# Altium schematic sheet ATB-Basics-PartA.SchDoc
size A4
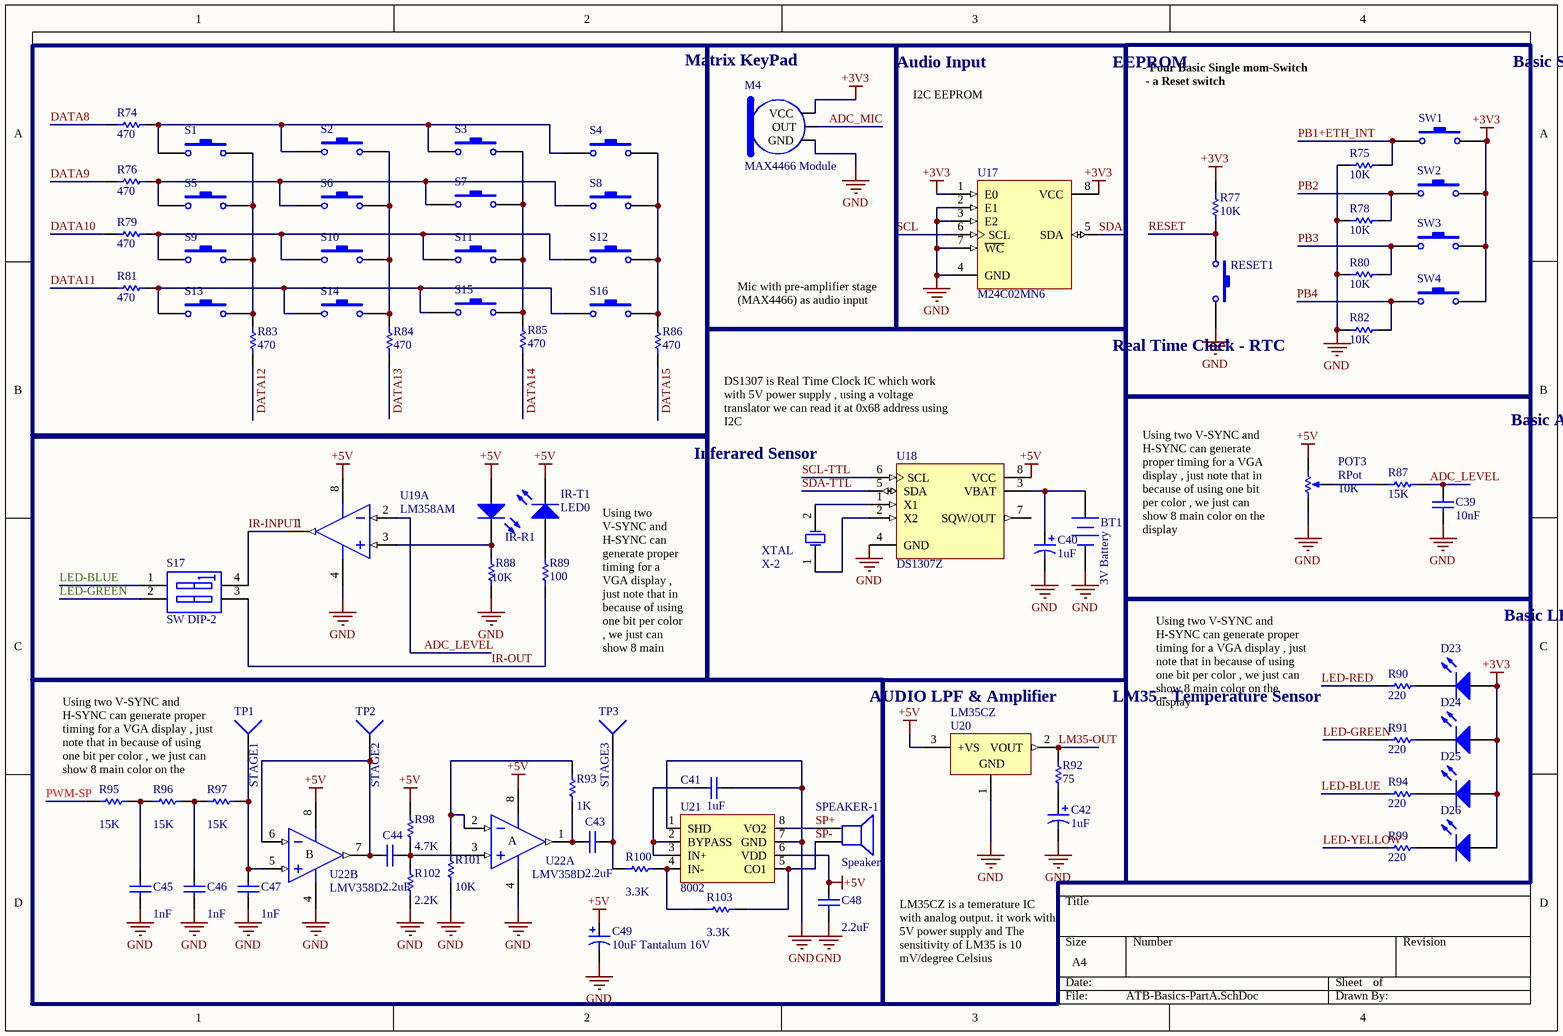
[diagram p0: ATB-Basics-PartA.SchDoc]

## Parts
BT1  3V Battery  [BAT-3V]
C39  10nF  [SMD_R0805]
C40  1uF  [SMD_C0805]
C41  1uF  [SMD_C0805]
C42  1uF  [SMD_C0805]
C43  2.2uF  [SMD_C0805]
C44  2.2uF  [SMD_C0805]
C45  1nF  [SMD_C0805]
C46  1nF  [SMD_C0805]
C47  1nF  [SMD_C0805]
C48  2.2uF  [SMD_C0805]
C49  10uF Tantalum 16V  [SMD_C3528-P]
D23  LED0  [3.5X2.8X1.9]  (value not drawn)
D24  LED0  [3.5X2.8X1.9]  (value not drawn)
D25  LED0  [3.5X2.8X1.9]  (value not drawn)
D26  LED0  [3.5X2.8X1.9]  (value not drawn)
IR-R1  (no value)  [LED-0]
IR-T1  LED0  [LED-0]
M4  MAX4466 Module  [MAX4466-Module]
POT3  RPot  value 10K  [volom]
R74  470  [SMD_R0805]
R75  10K  [SMD_R0805]
R76  470  [SMD_R0805]
R77  10K  [SMD_R0805]
R78  10K  [SMD_R0805]
R79  470  [SMD_R0805]
R80  10K  [SMD_R0805]
R81  470  [SMD_R0805]
R82  10K  [SMD_R0805]
R83  470  [SMD_R0805]
R84  470  [SMD_R0805]
R85  470  [SMD_R0805]
R86  470  [SMD_R0805]
R87  15K  [SMD_R0805]
R88  10K  [SMD_R0805]
R89  100  [SMD_R0805]
R90  220  [SMD_R0805]
R91  220  [SMD_R0805]
R92  75  [SMD_R0805]
R93  1K  [SMD_R0805]
R94  220  [SMD_R0805]
R95  15K  [SMD_R0805]
R96  15K  [SMD_R0805]
R97  15K  [SMD_R0805]
R98  4.7K  [SMD_R0805]
R99  220  [SMD_R0805]
R100  3.3K  [SMD_R0805]
R101  10K  [SMD_R0805]
R102  2.2K  [SMD_R0805]
R103  3.3K  [SMD_R0805]
RESET1  SW-PB  [mom-sw]  (value not drawn)
S1  SW-PB  [mom-sw]  (value not drawn)
S2  SW-PB  [mom-sw]  (value not drawn)
S3  SW-PB  [mom-sw]  (value not drawn)
S4  SW-PB  [mom-sw]  (value not drawn)
S5  SW-PB  [mom-sw]  (value not drawn)
S6  SW-PB  [mom-sw]  (value not drawn)
S7  SW-PB  [mom-sw]  (value not drawn)
S8  SW-PB  [mom-sw]  (value not drawn)
S9  SW-PB  [mom-sw]  (value not drawn)
S10  SW-PB  [mom-sw]  (value not drawn)
S11  SW-PB  [mom-sw]  (value not drawn)
S12  SW-PB  [mom-sw]  (value not drawn)
S13  SW-PB  [mom-sw]  (value not drawn)
S14  SW-PB  [mom-sw]  (value not drawn)
S15  SW-PB  [mom-sw]  (value not drawn)
S16  SW-PB  [mom-sw]  (value not drawn)
S17  SW DIP-2  [DIP-4]
SPEAKER-1  Speaker  [SPEAKER 2.5X1.5]
SW1  SW-PB  [SW-4PIN]  (value not drawn)
SW2  SW-PB  [SW-4PIN]  (value not drawn)
SW3  SW-PB  [SW-4PIN]  (value not drawn)
SW4  SW-PB  [SW-4PIN]  (value not drawn)
TP1  STAGE1  [TP]  (no BOM)
TP2  STAGE2  [TP]  (no BOM)
TP3  STAGE3  [TP]  (no BOM)
U17  M24C02MN6  [SOP8_N]
U18  DS1307Z  [SOIC8N_N]
U19  LM358AM  [M08A_N]  (part A of 2)
U20  LM35CZ  [Z03A]
U21  8002  [D008_M]
U22  LMV358D  [SO8_N]  (parts A,B of 2)
X-2  XTAL  [R38]

## Blocks framed on the sheet
Matrix KeyPad: R74 R76 R79 R81 R83-R86 S1-S16
Basic Switches: R75 R77 R78 R80 R82 RESET1 SW1-SW4
Real Time Clock - RTC: BT1 C40 U18 X-2
Basic ADC: C39 POT3 R87
Inferared Sensor: IR-R1 IR-T1 R88 R89 S17 U19
Basic LEDs: D23-D26 R90 R91 R94 R99
AUDIO LPF & Amplifier: C41 C43-C49 R93 R95-R98 R100-R103 SPEAKER-1 TP1-TP3 U21 U22

## Nets
+3V3: D23.1(A) D24.1(A) D25.1(A) D26.1(A) M4.1(VCC) R77.2 SW1.2 SW2.2 SW3.2 SW4.2 U17.1(E0) U17.8(VCC)
+5V: C48.1 C49.1 IR-R1.1(A) IR-T1.2(K) POT3.2(BOT) R98.2 U18.8(VCC) U19.8(V+) U20.3(+VS) U21.6(VDD) U22.8(V+)
GND: BT1.2(-) C39.1 C40.2 C41.1 C42.2 C45.1 C46.1 C47.1 C48.2 C49.2 M4.3(GND) POT3.1(TOP) R75.1 R78.1 R80.1 R82.1 R88.1 R101.1 R102.1 RESET1.2 U17.2(E1) U17.3(E2) U17.4(GND) U17.7(~{WC}) U18.4(GND) U19.4(GND) U20.1(GND) U21.1(SHD) U21.7(GND) U22.4(V-)
ADC_LEVEL: C39.2 R87.1 U19.2(IN-)
ADC_MIC: M4.2(OUT)
DATA8: R74.1
DATA9: R76.1
DATA10: R79.1
DATA11: R81.1
DATA12: R83.1
DATA13: R84.1
DATA14: R85.1
DATA15: R86.1
IR-INPUT: S17.4(B1) U19.1(OUT)
IR-OUT: R89.1 S17.3(B2)
LED-BLUE: R94.1 S17.1(A1)
LED-GREEN: R91.1 S17.2(A2)
LED-RED: R90.1
LED-YELLOW: R99.1
LM35-OUT: R92.2 U20.2(VOUT)
PB1+ETH_INT: R75.2 SW1.1
PB2: R78.2 SW2.1
PB3: R80.2 SW3.1
PB4: R82.2 SW4.1
PWM-SP: R95.1
RESET: R77.1 RESET1.1
SCL: U17.6(SCL)
SCL-TTL: U18.6(SCL)
SDA: U17.5(SDA)
SDA-TTL: U18.5(SDA)
SP+: SPEAKER-1.1 U21.8(VO2)
SP-: R103.1 SPEAKER-1.2 U21.5(CO1)
NetBT1_1: BT1.1(+) C40.1 U18.3(VBAT)
NetC41_2: C41.2 U21.2(BYPASS) U21.3(IN+)
NetC42_1: C42.1 R92.1
NetC43_1: C43.1 R100.2 TP3.1
NetC43_2: C43.2 R93.1 U22.1(OUT)
NetC44_1: C44.1 R98.1 R102.2 U22.3(IN+)
NetC44_2: C44.2 TP2.1 U22.6(IN-) U22.7(OUT)
NetC45_2: C45.2 R95.2 R96.1
NetC46_2: C46.2 R96.2 R97.1
NetC47_2: C47.2 R97.2 TP1.1 U22.5(IN+)
NetD23_2: D23.2(K) R90.2
NetD24_2: D24.2(K) R91.2
NetD25_2: D25.2(K) R94.2
NetD26_2: D26.2(K) R99.2
NetIR-R1_2: IR-R1.2(K) R88.2 U19.3(IN+)
NetIR-T1_1: IR-T1.1(A) R89.2
NetPOT3_3: POT3.3(TAP) R87.2
NetR74_2: R74.2 S1.1 S2.1 S3.1 S4.1
NetR76_2: R76.2 S5.1 S6.1 S7.1 S8.1
NetR79_2: R79.2 S9.1 S10.1 S11.1 S12.1
NetR81_2: R81.2 S13.1 S14.1 S15.1 S16.1
NetR83_2: R83.2 S1.2 S5.2 S9.2 S13.2
NetR84_2: R84.2 S2.2 S6.2 S10.2 S14.2
NetR85_2: R85.2 S3.2 S7.2 S11.2 S15.2
NetR86_2: R86.2 S4.2 S8.2 S12.2 S16.2
NetR93_2: R93.2 R101.2 U22.2(IN-)
NetR100_1: R100.1 R103.2 U21.4(IN-)
NetU18_1: U18.1(X1) X-2.2(OSC2)
NetU18_2: U18.2(X2) X-2.1(OSC1)

Not connected (* = marked no-connect by the designer): U18 7(SQW/OUT)

## Notes on the sheet
- (near M4) Audio Input
- EEPROM
- - Four Basic Single mom-Switch
  - a Reset switch
- I2C EEPROM
- Mic with pre-amplifier stage (MAX4466) as audio input
- (near U18) DS1307 is Real Time Clock IC which work with 5V power supply , using a voltage translator we can read it at 0x68 address using I2C
- Using two V-SYNC and H-SYNC can generate proper timing for a VGA display , just note that in because of using one bit per color , we just can show 8 main color on the display
- LM35 - Temperature Sensor
- LM35CZ is a temerature IC with analog output. it work with 5V power supply and The sensitivity of LM35 is 10 mV/degree Celsius
- (in symbol LM358D, part A) A
- (in symbol LM358D, part B) B

## Library data of the parts
BT1 = Battery: Multicell Battery; Published: 24-Mar-1999; LatestRevisionDate: 17-Jul-2002; LatestRevisionNote: Re-released for DXP Platform.; PackageReference: BAT-2; Publisher: Altium Limited
C39 C41 C43-C48 = Cap: Capacitor; Published: 8-Jun-2000; LatestRevisionDate: 17-Jul-2002; LatestRevisionNote: Re-released for DXP Platform.; PackageReference: RAD-0.3; Publisher: Altium Limited
  C39: Value: 10nF
  C41: PackageDescription: Radial Cap, Thru-Hole; 2 Leads; 0.3 in Pin Spacing; Value: 1uF
  C43 C44 C48: PackageDescription: Radial Cap, Thru-Hole; 2 Leads; 0.3 in Pin Spacing; Value: 2.2uF
  C45-C47: PackageDescription: Radial Cap, Thru-Hole; 2 Leads; 0.3 in Pin Spacing; Value: 1nF
C40 = Cap Pol1: Polarized Capacitor (Radial); Value: 2.2uF; Published: 8-Jun-2000; LatestRevisionDate: 17-Jul-2002; LatestRevisionNote: Re-released for DXP Platform.; PackageReference: RB7.6-15; Publisher: Altium Limited
C42 C49 = Cap Pol1: Polarized Capacitor (Radial); Published: 8-Jun-2000; LatestRevisionDate: 17-Jul-2002; LatestRevisionNote: Re-released for DXP Platform.; PackageReference: RB7.6-15; Publisher: Altium Limited
  C42: Value: 1uF
  C49: PackageDescription: Polarized Capacitor (Radial); 2 Leads; Value: 10uF
D23-D26 IR-R1 IR-T1 = LED0: Typical INFRARED GaAs LED; Published: 8-Jun-2000; LatestRevisionDate: 08-Jul-2005; LatestRevisionNote: Mech Layer 1 removed.; PackageReference: LED-0; Publisher: Altium Limited
M4 = MIC-MAX4466: Electret Microphone Amplifier
POT3 = RPot: Potentiometer; Sim Note: Enter the Resistance value and the set point into parameter fields.; Set Position: 0.5; Published: 8-Jun-2000; LatestRevisionDate: 17-Jul-2002; LatestRevisionNote: Re-released for DXP Platform.; PackageReference: VR5; Publisher: Altium Limited
R74-R103 = Res1: Resistor; Published: 8-Jun-2000; LatestRevisionDate: 17-Jul-2002; LatestRevisionNote: Re-released for DXP Platform.; PackageReference: AXIAL-0.3; Publisher: Altium Limited
  R74 R76 R79 R81 R83-R86: Value: 470
  R75 R77 R78 R80 R82 R88: Value: 10K
  R87: Value: 15K
  R89: Value: 100
  R90 R91 R94 R99: Value: 220
  R92: Value: 75
  R93: PackageDescription: Axial Device, Thru-Hole; 2 Leads; 0.3 in Pin Spacing; Value: 1K
  R95-R97: PackageDescription: Axial Device, Thru-Hole; 2 Leads; 0.3 in Pin Spacing; Value: 15K
  R98: PackageDescription: Axial Device, Thru-Hole; 2 Leads; 0.3 in Pin Spacing; Value: 4.7K
  R100 R103: PackageDescription: Axial Device, Thru-Hole; 2 Leads; 0.3 in Pin Spacing; Value: 3.3K
  R101: PackageDescription: Axial Device, Thru-Hole; 2 Leads; 0.3 in Pin Spacing; Value: 10K
  R102: PackageDescription: Axial Device, Thru-Hole; 2 Leads; 0.3 in Pin Spacing; Value: 2.2K
RESET1 S1-S16 SW1-SW4 = SW-PB: Switch; Published: 24-Mar-1999; LatestRevisionDate: 17-Jul-2002; LatestRevisionNote: Re-released for DXP Platform.; PackageReference: SPST-2; Publisher: Altium Limited
S17 = SW DIP-2: DIP Switch, 2 Position, SPST; Published: 24-Mar-1999; LatestRevisionDate: 17-Jul-2002; LatestRevisionNote: Re-released for DXP Platform.; PackageReference: DIP-4; Publisher: Altium Limited
SPEAKER-1 = Speaker: Loudspeaker; pin to pad: 1>2 2>1; Published: 24-Mar-1999; LatestRevisionDate: 17-Jul-2002; LatestRevisionNote: Re-released for DXP Platform.; PackageReference: PIN2; Publisher: Altium Limited
TP1-TP3 = Socket: LatestRevisionDate: 17-Jul-2002; LatestRevisionNote: Re-released for DXP Platform.; Publisher: Altium Limited
U17 = M24C02MN6: 2Kbit Serial I²C Bus EEPROM; Published: 24-Aug-2001; LatestRevisionDate: 13-Apr-2006; LatestRevisionNote: IPC-7351 Footprint Added.; DatasheetVersion: Sep-1999; PackageVersion: Jul-1999; PackageReference: SOP8; Publisher: Altium Limited; PackageDescription: 8-Pin Small Outline Integrated Circuit 1.27 mm Pitch; ComponentLink1Description: Manufacturer Link; ComponentLink1URL: http://www.st.com/; ComponentLink2Description: Datasheet; ComponentLink2URL: http://www.st.com/stonline/products/literature/ds/5067/m24c01-r.pdf
U18 = DS1307Z: 64 X 8 Serial Real-Time Clock; Published: 13-Oct-2000; LatestRevisionDate: 13-Apr-2006; LatestRevisionNote: IPC-7351 Footprint Added.; DatasheetVersion: 10-Aug-1999; PackageVersion: 1999; PackageReference: SOIC8N; Publisher: Altium Limited; PackageDescription: 8-Pin Small Outline Integrated Circuit 1.27 mm Pitch; Code_IPC: SOIC127P600-8; ComponentLink1Description: Manufacturer Link; ComponentLink1URL: http://www.maxim-ic.com/; ComponentLink2Description: Datasheet; ComponentLink2URL: http://pdfserv.maxim-ic.com/en/ds/DS1307.pdf; ComponentLink3Description: Discontinuation Notice; ComponentLink3URL: http://www.maxim-ic.com/qa/pdfs/non-obsolescence-letter.pdf
U19 = LM358AM: Low-Power Dual Operational Amplifier; Published: 15-Apr-2002; LatestRevisionDate: 13-Apr-2006; LatestRevisionNote: IPC-7351 Footprint Added.; DatasheetVersion: Sep-1999; PackageVersion: Sep-1997; PackageReference: M08A; Publisher: Altium Limited; PackageDescription: 8-Pin Small Outline Integrated Circuit 1.27 mm Pitch; Code_JEDEC: MS-012-AA; Code_IPC: SOIC127P600-8; ComponentLink1Description: Manufacturer Link; ComponentLink1URL: http://www.national.com/; ComponentLink2Description: Datasheet; ComponentLink2URL: http://www.national.com/ds.cgi/LM/LM158.pdf; ComponentLink3Description: URL Link1; ComponentLink3URL: http://www.national.com/pf/LM/LM358.html
U20 = LM35CZ: Precision CentigradeTemperature Sensor; Published: 15-Apr-2002; DatasheetVersion: Sep-1997; PackageVersion: 2000; PackageReference: Z03A; Publisher: Altium Limited; PackageDescription: TO, Flat Index; 3 In-Line, Axial Leads; Body Dia. 4.6mm; Leads 0.53 x 0.39 mm (max); ComponentLink1Description: Manufacturer Link; ComponentLink1URL: http://www.national.com/; ComponentLink2Description: Datasheet; ComponentLink2URL: http://www.national.com/ds.cgi/LM/LM35.pdf; ComponentLink3Description: URL Link1; ComponentLink3URL: http://www.national.com/pf/LM/LM35.html
U21 = 8002: 8002  Class-AB audio power amplifier
U22 = LM358D: Dual Low-Power Operational Amplifier; Published: 24-Aug-2001; LatestRevisionDate: 13-Apr-2006; LatestRevisionNote: IPC-7351 Footprint Added.; PackageVersion: Dec-2002; PackageReference: SO8; Publisher: Altium Limited; PackageDescription: 8-Pin Small Outline Integrated Circuit 1.27 mm Pitch; Code_JEDEC: MS-012-AA; Code_IPC: SOIC127P600-8; ComponentLink1Description: Manufacturer Link; ComponentLink1URL: http://www.st.com/; ComponentLink2Description: Datasheet; ComponentLink2URL: http://www.st.com/stonline/products/literature/ds/2163/lm358.pdf
X-2 = XTAL: Crystal Oscillator; Published: 8-Jun-2000; LatestRevisionDate: 17-Jul-2002; LatestRevisionNote: Re-released for DXP Platform.; PackageReference: R38; Publisher: Altium Limited